# EAGLE design vixen1 (EAGLE 7.7.0)
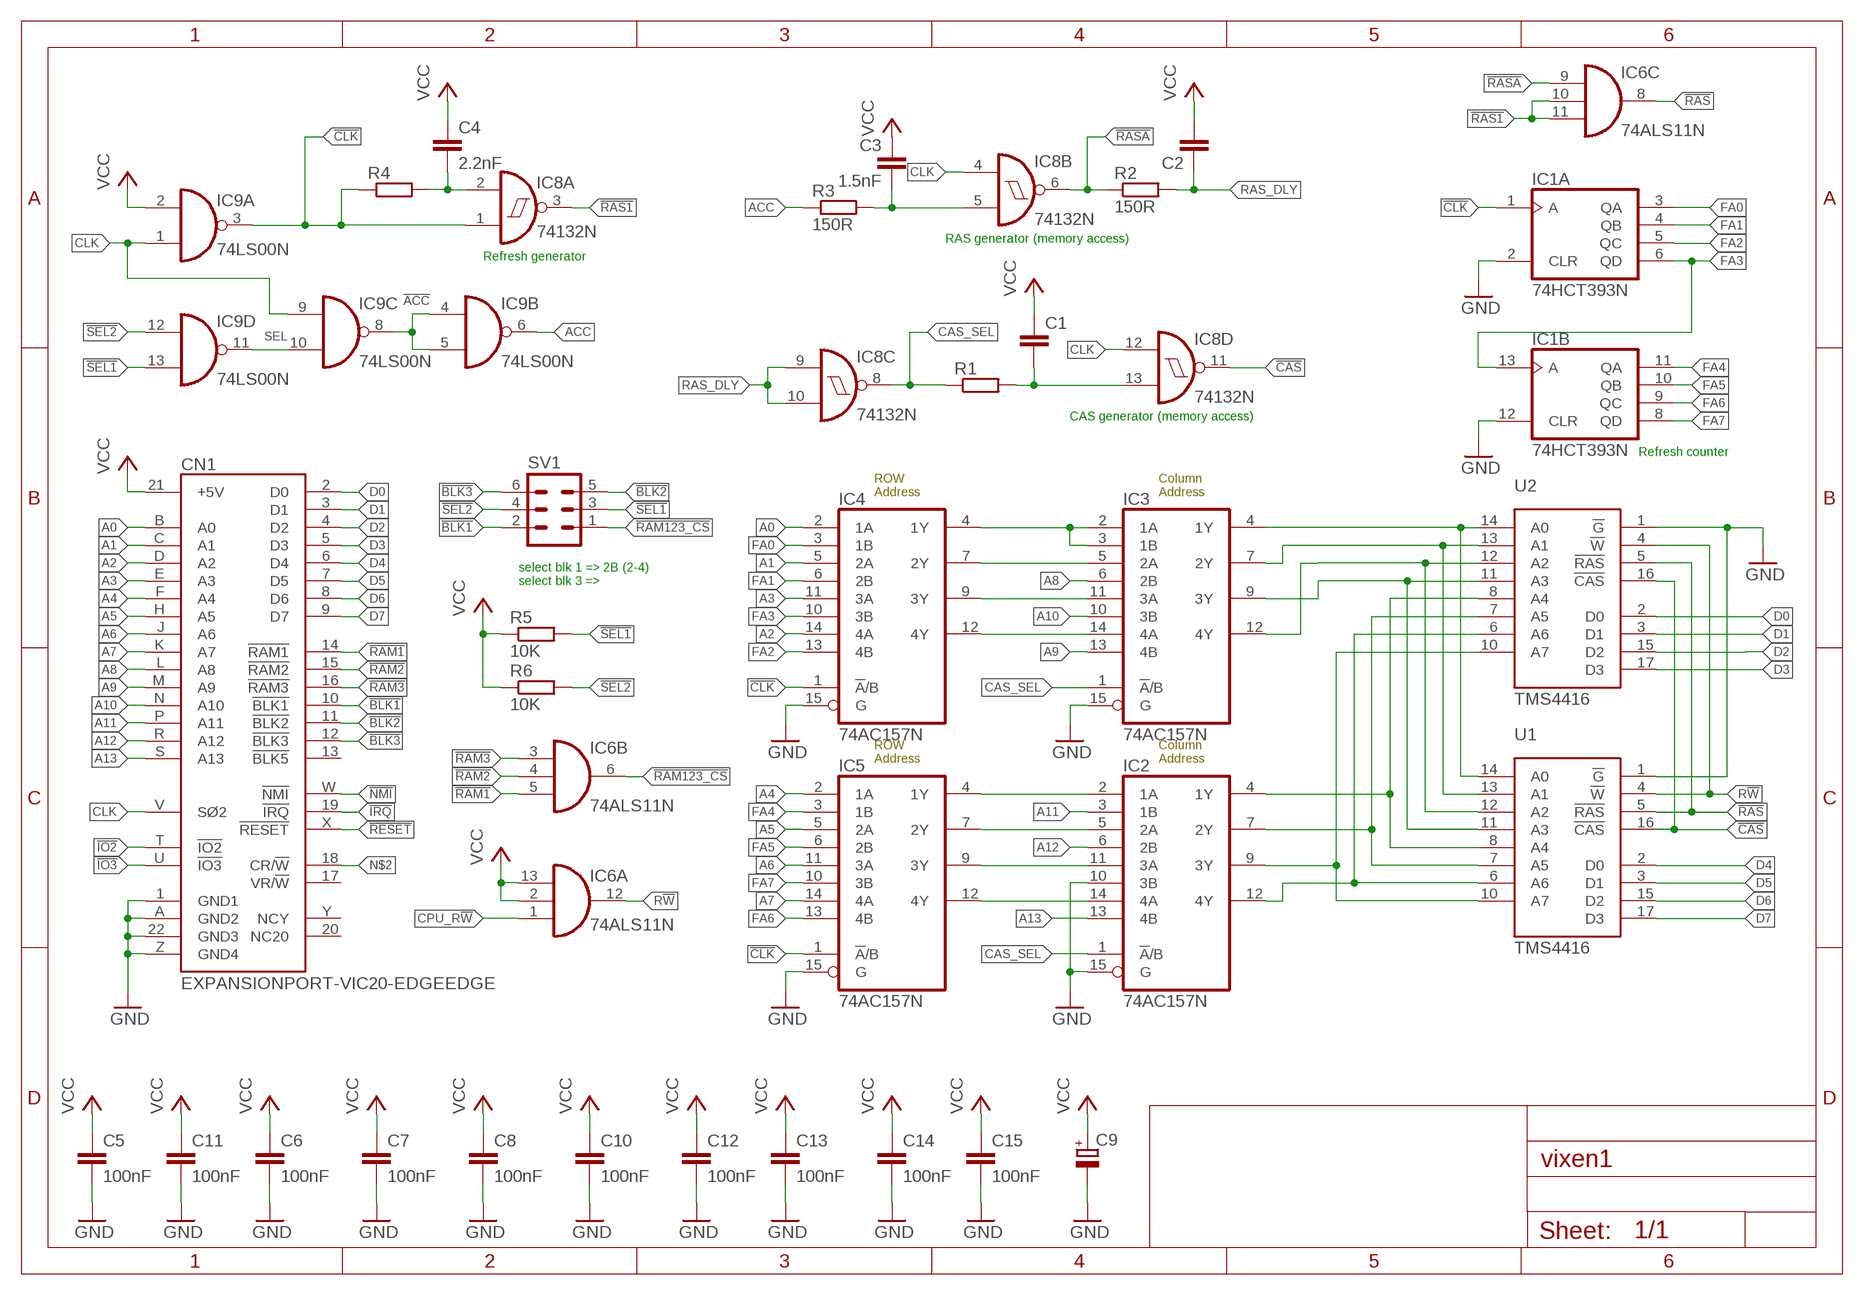
[diagram p0: schematic, sheet 1]

## Parts
C1  C-EU025-025X050  [C025-025X050]
C2  C-EU025-025X050  [C025-025X050]
C3  1.5nF  C-EU025-025X050  [C025-025X050]
C4  2.2nF  C-EU025-025X050  [C025-025X050]
C5  100nF  C-EU025-025X050  [C025-025X050]
C6  100nF  C-EU025-025X050  [C025-025X050]
C7  100nF  C-EU025-025X050  [C025-025X050]
C8  100nF  C-EU025-025X050  [C025-025X050]
C9  CPOL-EUE15-5AXIAL  [E15-5]
C10  100nF  C-EU025-025X050  [C025-025X050]
C11  100nF  C-EU025-025X050  [C025-025X050]
C12  100nF  C-EU025-025X050  [C025-025X050]
C13  100nF  C-EU025-025X050  [C025-025X050]
C14  100nF  C-EU025-025X050  [C025-025X050]
C15  100nF  C-EU025-025X050  [C025-025X050]
CN1  EXPANSIONPORT-VIC20-EDGEEDGE  [UPS44EDGE]
IC1  74HCT393N  [DIL14]
IC2  74AC157N  [DIL16]
IC3  74AC157N  [DIL16]
IC4  74AC157N  [DIL16]
IC5  74AC157N  [DIL16]
IC6  74ALS11N  [DIL14]
IC8  74132N  [DIL14]
IC9  74LS00N  [DIL14]
R1  R-EU_0204/7  [0204/7]
R2  150R  R-EU_0204/7  [0204/7]
R3  150R  R-EU_0204/7  [0204/7]
R4  R-EU_0204/7  [0204/7]
R5  10K  R-EU_0204/7  [0204/7]
R6  10K  R-EU_0204/7  [0204/7]
SV1  MA03-2  [MA03-2]
U1  TMS4416  [DIL18]
U2  TMS4416  [DIL18]

## Nets
!ACC: IC9.4(B:I0) IC9.5(B:I1) IC9.8(C:O)
!BLK1: CN1.10(!BLK1) SV1.2
!BLK2: CN1.11(!BLK2) SV1.5
!BLK3: CN1.12(!BLK3) SV1.6
!CAS: IC8.11(D:O) U1.16(!CAS) U2.16(!CAS)
!CLK: IC1.1(A:A) IC4.1(!A!/B) IC5.1(!A!/B) IC8.1(A:I0) IC9.3(A:O) R4.1
!IO2: CN1.T(!IO2)
!IO3: CN1.U(!IO3)
!IRQ: CN1.19(!IRQ)
!NMI: CN1.W(!NMI)
!RAM1: CN1.14(!RAM1) IC6.5(B:I2)
!RAM2: CN1.15(!RAM2) IC6.4(B:I1)
!RAM3: CN1.16(!RAM3) IC6.3(B:I0)
!RAM123_CS: IC6.6(B:O) SV1.1
!RAS: IC6.8(C:O) U1.5(!RAS) U2.5(!RAS)
!RAS1: IC6.10(C:I1) IC6.11(C:I2) IC8.3(A:O)
!RASA: IC6.9(C:I0) IC8.6(B:O) R2.1
!RESET: CN1.X(!RESET)
!SEL1: IC9.13(D:I1) R5.2 SV1.3
!SEL2: IC9.12(D:I0) R6.2 SV1.4
A0: CN1.B(A0) IC4.2(1A)
A1: CN1.C(A1) IC4.5(2A)
A2: CN1.D(A2) IC4.14(4A)
A3: CN1.E(A3) IC4.11(3A)
A4: CN1.F(A4) IC5.2(1A)
A5: CN1.H(A5) IC5.5(2A)
A6: CN1.J(A6) IC5.11(3A)
A7: CN1.K(A7) IC5.14(4A)
A8: CN1.L(A8) IC3.6(2B)
A9: CN1.M(A9) IC3.13(4B)
A10: CN1.N(A10) IC3.10(3B)
A11: CN1.P(A11) IC2.3(1B)
A12: CN1.R(A12) IC2.6(2B)
A13: CN1.S(A13) IC2.13(4B)
ACC: IC9.6(B:O) R3.1
CAS_RC: C1.2 IC8.13(D:I1) R1.2
CAS_RC1: C4.2 IC8.2(A:I1) R4.2
CAS_SEL: IC2.1(!A!/B) IC3.1(!A!/B) IC8.8(C:O) R1.1
CLK: CN1.V(SØ2) IC8.4(B:I0) IC8.12(D:I0) IC9.1(A:I0) IC9.9(C:I0)
CPU_R!W: IC6.1(A:I0)
D0: CN1.2(D0) U2.2(D0)
D1: CN1.3(D1) U2.3(D1)
D2: CN1.4(D2) U2.15(D2)
D3: CN1.5(D3) U2.17(D3)
D4: CN1.6(D4) U1.2(D0)
D5: CN1.7(D5) U1.3(D1)
D6: CN1.8(D6) U1.15(D2)
D7: CN1.9(D7) U1.17(D3)
FA0: IC1.3(A:QA) IC4.3(1B)
FA1: IC1.4(A:QB) IC4.6(2B)
FA2: IC1.5(A:QC) IC4.13(4B)
FA3: IC1.6(A:QD) IC1.13(B:A) IC4.10(3B)
FA4: IC1.11(B:QA) IC5.3(1B)
FA5: IC1.10(B:QB) IC5.6(2B)
FA6: IC1.9(B:QC) IC5.13(4B)
FA7: IC1.8(B:QD) IC5.10(3B)
GND: C5.2 C6.2 C7.2 C8.2 C9.- C10.2 C11.2 C12.2 C13.2 C14.2 C15.2 CN1.1(GND1) CN1.22(GND3) CN1.A(GND2) CN1.Z(GND4) IC1.2(A:CLR) IC1.12(B:CLR) IC2.10(3B) IC2.15(G) IC3.15(G) IC4.15(G) IC5.15(G) U1.1(!G) U2.1(!G)
N$2: CN1.18(CR/!W)
R!W: IC6.12(A:O) U1.4(!W) U2.4(!W)
RA0: IC3.4(1Y) U1.14(A0) U2.14(A0)
RA1: IC3.7(2Y) U1.13(A1) U2.13(A1)
RA2: IC3.12(4Y) U1.12(A2) U2.12(A2)
RA3: IC3.9(3Y) U1.11(A3) U2.11(A3)
RA4: IC2.4(1Y) U1.8(A4) U2.8(A4)
RA5: IC2.7(2Y) U1.7(A5) U2.7(A5)
RA6: IC2.12(4Y) U1.6(A6) U2.6(A6)
RA7: IC2.9(3Y) U1.10(A7) U2.10(A7)
RAS_DLY: C2.1 IC8.9(C:I0) IC8.10(C:I1) R2.2
RAS_RC1: C3.2 IC8.5(B:I1) R3.2
ROW0: IC3.2(1A) IC3.3(1B) IC4.4(1Y)
ROW1: IC3.5(2A) IC4.7(2Y)
ROW2: IC3.14(4A) IC4.12(4Y)
ROW3: IC3.11(3A) IC4.9(3Y)
ROW4: IC2.2(1A) IC5.4(1Y)
ROW5: IC2.5(2A) IC5.7(2Y)
ROW6: IC2.14(4A) IC5.12(4Y)
ROW7: IC2.11(3A) IC5.9(3Y)
SEL: IC9.10(C:I1) IC9.11(D:O)
VCC: C1.1 C2.2 C3.1 C4.1 C5.1 C6.1 C7.1 C8.1 C9.+ C10.1 C11.1 C12.1 C13.1 C14.1 C15.1 CN1.21(+5V) IC6.2(A:I1) IC6.13(A:I2) IC9.2(A:I1) R5.1 R6.1
Unconnected: CN1.13(!BLK5) CN1.17(VR/!W) CN1.20(NC20) CN1.Y(NCY)

## Notes on the sheet
- RAS generator (memory access)
- Refresh generator
- CAS generator (memory access)
- Refresh counter
- ROW
  Address
- Column
  Address
- select blk 1 => 2B (2-4)
  select blk 3 =>
- ROW
  Address
- Column
  Address

## Power pins joined to a net without a drawn wire
GND: IC1.7(P:GND) IC2.8(GND) IC3.8(GND) IC4.8(GND) IC5.8(GND) IC6.7(P:GND) IC8.7(P:GND) IC9.7(P:GND) U1.18(GND) U2.18(GND)
VCC: IC1.14(P:VCC) IC2.16(VCC) IC3.16(VCC) IC4.16(VCC) IC5.16(VCC) IC6.14(P:VCC) IC8.14(P:VCC) IC9.14(P:VCC) U1.9(VCC) U2.9(VCC)

## Library data of the parts
C1-C8 C10-C15 = rcl:C-EU: CAPACITOR, European symbol
C9 = rcl:CPOL-EU: POLARIZED CAPACITOR, European symbol
CN1 = 0RB_Commodore:EXPANSIONPORT-VIC20-EDGE: Expansionport of the Commodore VIC-20
IC1 = 74xx-eu:74*393: Dual 4-bit decade and binary COUNTER
IC2-IC5 = 74xx-eu:74*157: Quadruple 2-line to 1-line data SELECTOR/MULTIPLEXER
IC6 = 74xx-eu:74*11: Triple 3-input AND gate
IC8 = 74xx-eu:74*132: Quad 2-input NAND schmitt trigger
IC9 = 74xx-eu:74*00: Quad 2-input NAND gate
R1-R6 = rcl:R-EU_: RESISTOR, European symbol
SV1 = con-lstb:MA03-2: PIN HEADER; OC_FARNELL: unknown; OC_NEWARK: unknown
U1 U2 = tms4416:TMS4416

## Board
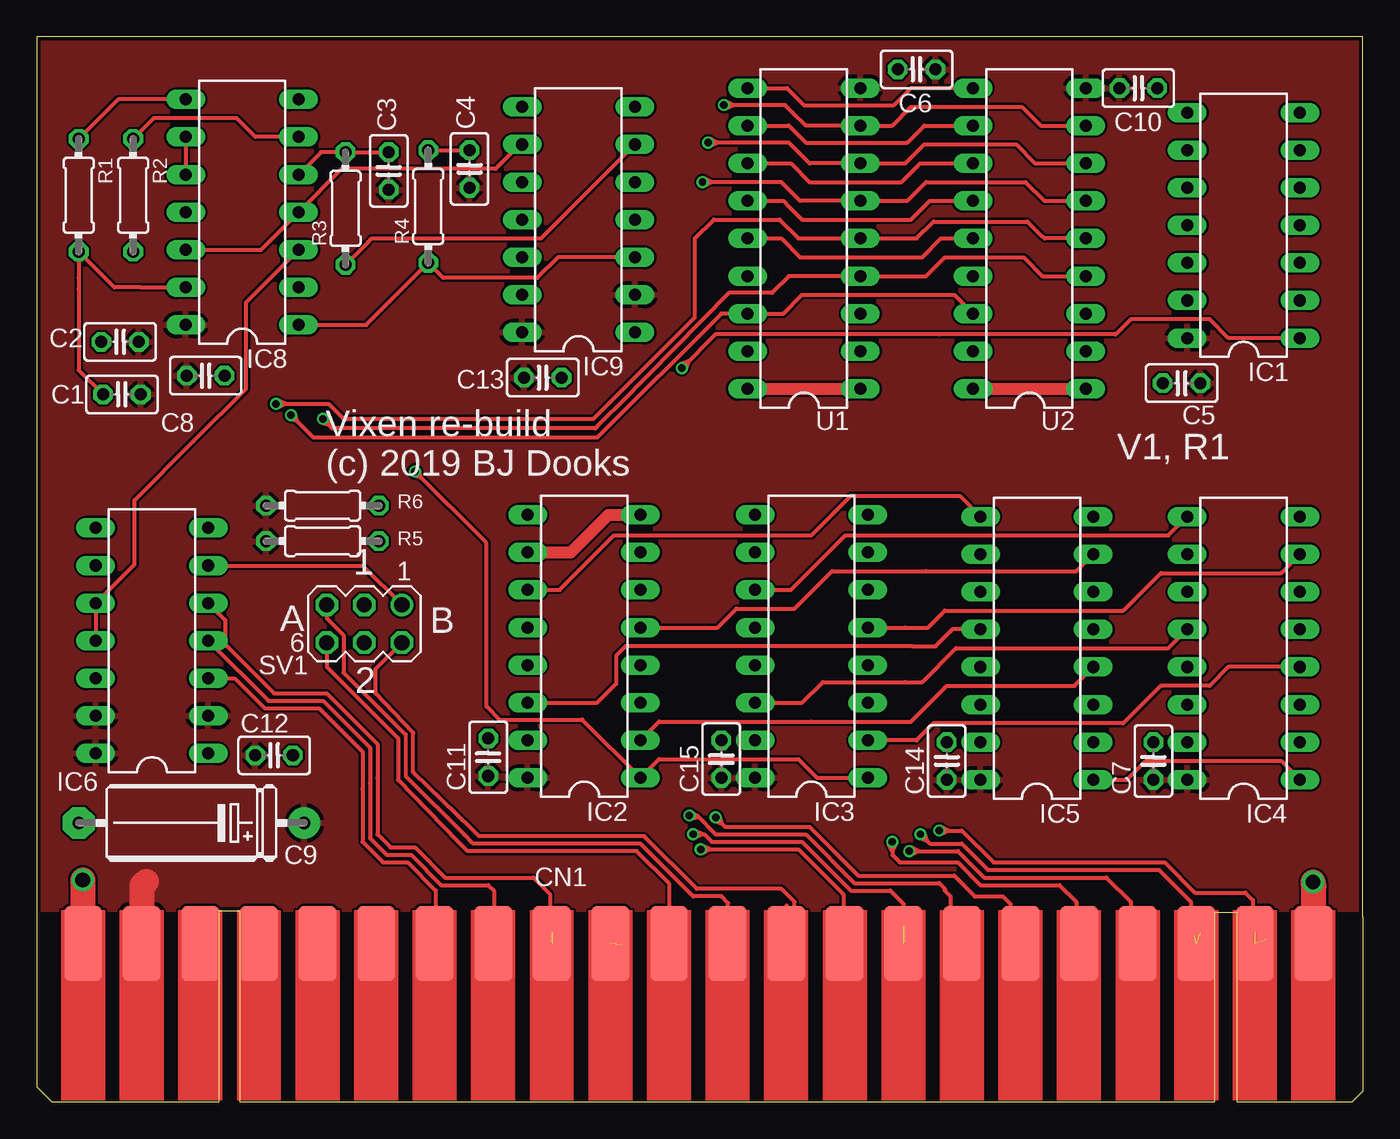
[diagram p1: board, top side]
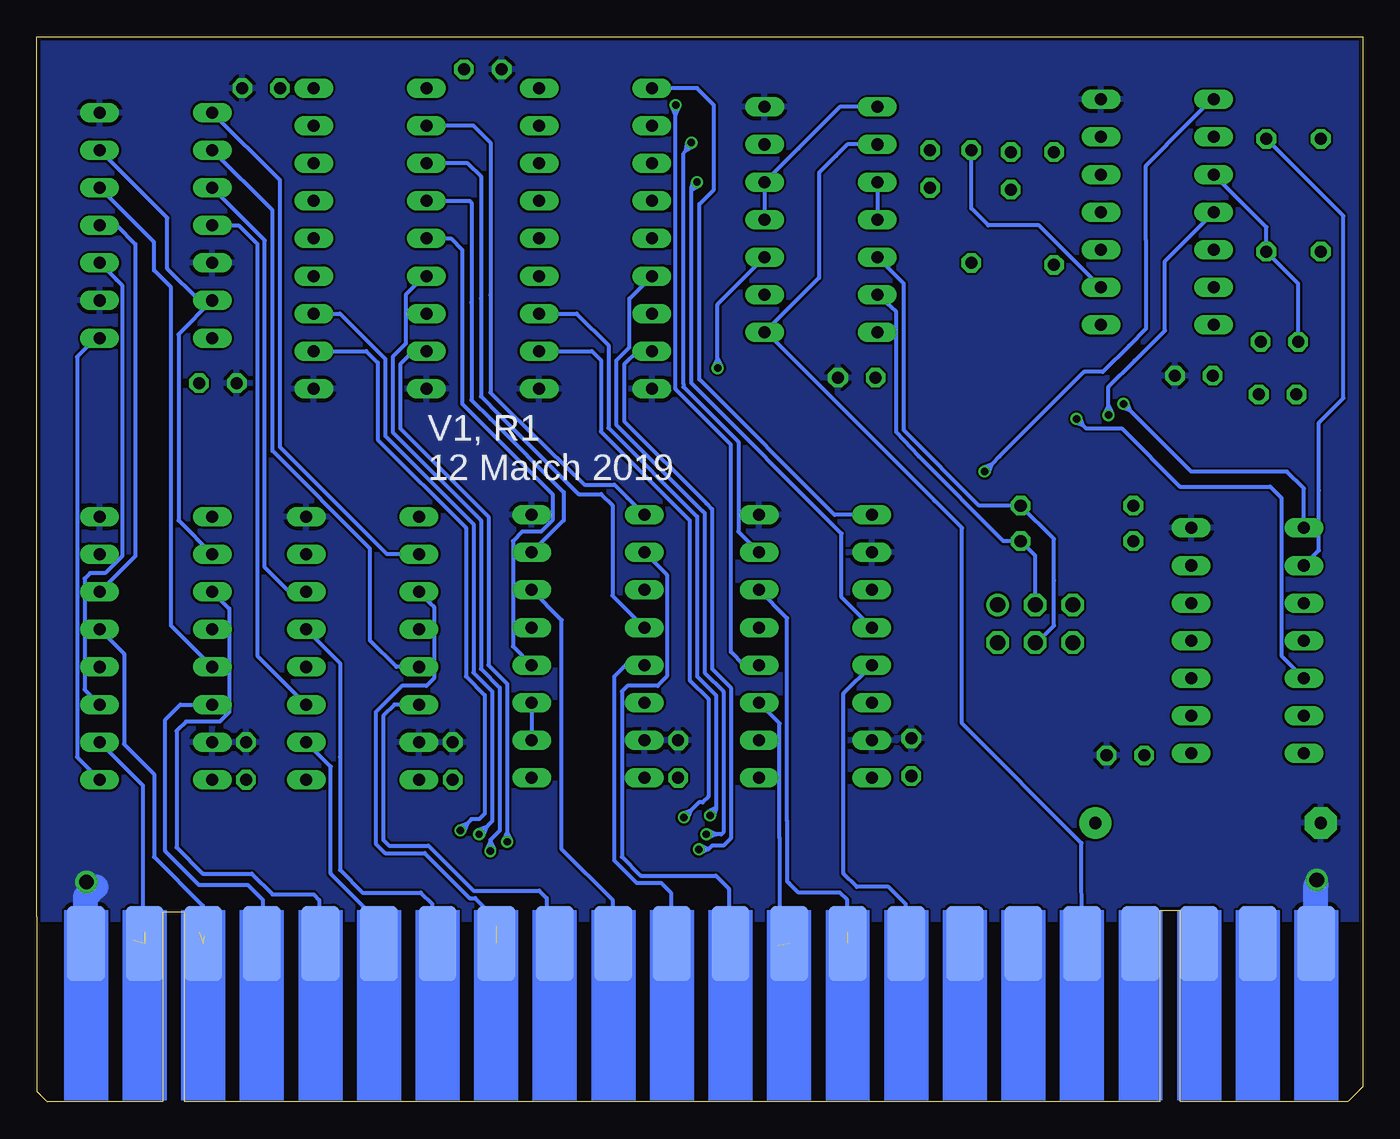
[diagram p2: board, bottom side, seen from below]

Size 89.6 x 71.93 mm. Coordinates in mm from the lower left corner, seen from the top.
Outline: 89.6,12.47 89.6,71.93 0,71.93 0,12.62
Copper layers (1*16): Top 0.035mm / dielectric 1.5mm / Bottom 0.035mm
Design rules "Elecrow_2-layer_eagle_rule *": minimum track width 6mil, minimum drill 12mil, track to track 6mil, track to pad 6mil, pad to pad 6mil, via to via 6mil, smd to smd 0mil, copper to edge 10mil, drill to drill 10mil, minimum pad ring 10mil, minimum via ring 6mil, stop-mask expansion 2mil, vias tented up to drill 100mil, thermal gap 10mil

### Footprints (pad centres in the part's own frame; a part is rotated, then mirrored left to right if it is on the bottom)
C025-025X050 = drill 0.813 octagon: 1 -1.27,0; 2 1.27,0
E15-5 = drill 0.813 pad 2.159: + -7.62,0 | drill 0.813 pad 2.159 octagon: - 7.62,0
UPS44EDGE = smd 2.54 x 5.08: 1 41.581,3.68; 2 37.621,3.68; 3 33.661,3.68; 4 29.701,3.68; 5 25.741,3.68; 6 21.781,3.68; 7 17.821,3.68; 8 13.861,3.68; 9 9.901,3.68; 10 5.941,3.68; 11 1.981,3.68; 12 -1.979,3.68; 13 -5.939,3.68; 14 -9.899,3.68; 15 -13.859,3.68; 16 -17.819,3.68; 17 -21.779,3.68; 18 -25.739,3.68; 19 -29.699,3.68; 20 -33.659,3.68; 21 -37.619,3.68; 22 -41.579,3.68 | smd 2.54 x 5.08 bottom: A 41.581,3.68; B 37.621,3.68; C 33.661,3.68; D 29.701,3.68; E 25.741,3.68; F 21.781,3.68; H 17.821,3.68; J 13.861,3.68; K 9.901,3.68; L 5.941,3.68; M 1.981,3.68; N -1.979,3.68; P -5.939,3.68; R -9.899,3.68; S -13.859,3.68; T -17.819,3.68; U -21.779,3.68; V -25.739,3.68; W -29.699,3.68; X -33.659,3.68; Y -37.619,3.68; Z -41.579,3.68
DIL14 = drill 0.813 long: 1 -7.62,-3.81; 2 -5.08,-3.81; 3 -2.54,-3.81; 4 0,-3.81; 5 2.54,-3.81; 6 5.08,-3.81; 7 7.62,-3.81; 8 7.62,3.81; 9 5.08,3.81; 10 2.54,3.81; 11 0,3.81; 12 -2.54,3.81; 13 -5.08,3.81; 14 -7.62,3.81
DIL16 = drill 0.813 long: 1 -8.89,-3.81; 2 -6.35,-3.81; 3 -3.81,-3.81; 4 -1.27,-3.81; 5 1.27,-3.81; 6 3.81,-3.81; 7 6.35,-3.81; 8 8.89,-3.81; 9 8.89,3.81; 10 6.35,3.81; 11 3.81,3.81; 12 1.27,3.81; 13 -1.27,3.81; 14 -3.81,3.81; 15 -6.35,3.81; 16 -8.89,3.81
0204/7 = drill 0.813 octagon: 1 -3.81,0; 2 3.81,0
MA03-2 = drill 1.016: 1 -2.54,-1.27 | drill 1.016 octagon: 2 -2.54,1.27; 3 0,-1.27; 4 0,1.27; 5 2.54,-1.27; 6 2.54,1.27
DIL18 = drill 0.813 long: 1 -10.16,-3.81; 2 -7.62,-3.81; 3 -5.08,-3.81; 4 -2.54,-3.81; 5 0,-3.81; 6 2.54,-3.81; 7 5.08,-3.81; 8 7.62,-3.81; 9 10.16,-3.81; 10 10.16,3.81; 11 7.62,3.81; 12 5.08,3.81; 13 2.54,3.81; 14 0,3.81; 15 -2.54,3.81; 16 -5.08,3.81; 17 -7.62,3.81; 18 -10.16,3.81

### Placement (x,y rotation side)
C1  5.74,47.78 180 top
C2  5.61,51.33 0 top
C3  23.78,62.89 90 top
C4  29.24,63.02 90 top
C5  77.37,48.54 180 top
C6  59.46,69.75 180 top
C7  75.46,23.01 90 top
C8  11.4,49.05 0 top
C9  10.44,18.82 180 top
C10  74.45,68.48 0 top
C11  30.51,23.27 90 top
C12  16.03,23.39 0 top
C13  34.19,48.92 0 top
C14  61.49,23.01 90 top
C15  46.25,23.14 90 top
CN1  44.7,7 0 top
IC1  81.56,59.21 90 top
IC2  36.98,30.76 90 top
IC3  52.35,30.76 90 top
IC4  81.56,30.63 90 top
IC5  67.59,30.63 90 top
IC6  7.77,31.14 90 top
IC8  13.87,60.09 90 top
IC9  36.6,59.59 90 top
R1  2.82,61.24 270 top
R2  6.5,61.24 270 top
R3  20.85,60.35 90 top
R4  26.44,60.48 90 top
R5  19.3,37.87 0 top
R6  19.3,40.27 0 top
SV1  22.12,32.28 180 top
U1  51.84,58.32 90 top
U2  67.08,58.32 90 top

### Tracks (layer width: path | path; a pad name or v marks a point on that pad's centre or on a via)
!ACC
  Bottom 0.254: IC9.4 IC9.5 38.13,64.41 36.35,66.19 35.33,67.21 IC9.8
!BLK1
  Top 0.254: CN1.10 50.67,13.26 50.67,12.5 51.21,11.96 51.21,13.49 50.32,14.38 44.6,14.38 41.05,17.93 29.87,17.93 29.36,18.44 25.43,22.25 25.43,24.92 22.89,27.58 22.89,29.23 SV1.2
!BLK2
  Top 0.254: SV1.5 19.58,32.66 20.73,31.52 20.73,28.98 24.92,24.79 24.92,22 28.86,18.06 29.49,17.42 40.79,17.42 44.35,13.87 46.25,13.87 46.71,13.41 CN1.11
!BLK3
  Top 0.254: SV1.6 19.58,29.36 24.41,24.54 24.41,21.74 28.47,17.55 29.11,16.91 40.54,16.91 42.75,14.7 CN1.12 42.83,10.76
!CAS  (via drill 0.5)
  Top 0.254: 18.7,44.86 18.57,44.98 | 18.57,44.98 v17.17,46.38 | 18.7,44.86 37.87,44.86 46.25,53.24 U1.16 50.45,53.24 51.72,54.51 62,54.51 U2.16 | 18.7,44.86 18.57,44.98 | v17.17,46.38 17.43,46.47 17.63,45.92 17.08,46.12 v17.17,46.38
  Bottom 0.254: v17.17,46.38 17.17,48.28 15.39,50.06 15.27,50.19 13.36,52.09 13.36,56.79 IC8.11 | v17.17,46.38 16.92,46.5 17.17,47.03 17.42,46.5 v17.17,46.38
!CLK  (via drill 0.5)
  Top 0.254: IC8.1 22.25,52.47 R4.1 27.46,55.65 33.81,55.65 35.21,57.05 IC9.3 | IC1.1 80.54,51.59 79.27,52.86 73.94,52.86 72.92,51.84 60.99,51.84 45.87,51.84 v43.59,49.55 | IC5.1 73.69,21.74 74.83,22.88 74.96,23.01 84.1,23.01 IC4.1 | v43.59,49.55 43.49,49.81 44.05,50.01 43.85,49.46 v43.59,49.55
  Bottom 0.254: v43.59,49.55 43.59,53.87 IC9.3 | IC1.1 85.62,51.59 86.89,50.32 86.89,23.27 IC4.1 | v43.59,49.55 43.34,49.67 43.59,50.2 43.84,49.67 v43.59,49.55
!RAM1  (1 unrouted)
  Top 0.254: IC6.5 12.73,32.54 12.73,30.88 16.03,27.58 19.58,27.58 23.01,24.15 23.01,21.87 23.01,18.06 23.9,17.17 25.55,17.17 27.59,15.14 33.55,15.14 34.7,13.99 34.7,11.58 34.82,11.45
!RAM2
  Top 0.254: IC6.4 15.65,27.07 19.33,27.07 22.51,23.9 22.51,21.49 22.51,17.8 23.52,16.79 23.65,16.66 25.3,16.66 27.33,14.63 30.51,14.63 30.89,14.25 30.89,11.58 31.4,11.07 31,11.07 30.87,11.2 | CN1.15 30.87,11.2 | 30.87,11.2 30.87,13.12
!RAM3
  Top 0.254: IC6.3 13.36,28.6 15.39,26.57 19.08,26.57 22,23.65 22,21.11 22,17.55 23.39,16.15 25.05,16.15 26.95,14.25 26.95,11.45 26.82,11.33 26.82,10.78 CN1.16
!RAM123_CS
  Top 0.254: IC6.6 22,36.22 SV1.1
!RAS  (via drill 0.5)
  Top 0.254: U2.5 68.1,58.32 67.97,58.44 66.95,59.46 60.61,59.46 59.46,58.32 U1.5 51.46,58.32 50.19,59.59 45.75,59.59 44.48,58.32 44.48,52.98 38.63,47.14 37.62,46.12 20.73,46.12 19.71,47.14 v16.16,47.14 | v16.16,47.14 16.27,47.39 16.81,47.14 16.27,46.89 v16.16,47.14
  Bottom 0.254: IC6.8 3.96,41.43 5.11,42.57 11.58,42.57 v16.16,47.14 | v16.16,47.14 16.25,46.88 15.7,46.68 15.9,47.23 v16.16,47.14
!RAS1
  Top 0.254: IC6.11 IC6.10 6.6,36.32 6.6,40.63 10.57,44.6 14.12,48.16 14.12,54 IC8.3
!RASA
  Top 0.254: IC8.6 14.76,65.17 13.49,66.44 7.9,66.44 R2.1
  Bottom 0.254: IC6.9 2.95,37.23 2.95,41.3 2.95,45.87 1.93,46.89 1.3,47.52 1.3,59.84 R2.1
!SEL1
  Bottom 0.254: IC9.13 31.52,53.36 31.52,45.24 30,43.58 24.28,37.87 R5.2 22.12,36.88 SV1.3
!SEL2
  Bottom 0.254: SV1.4 22,31.01 20.85,32.16 20.85,35.2 20.85,38.01 R6.2 25.92,40.27 31.01,45.36 31.01,55.27 IC9.12
A0  (1 unrouted)
  Bottom 0.254: IC4.2 82.45,21.36 82.45,11.58 83.08,10.95
A1  (1 unrouted)
  Bottom 0.254: IC4.5 83.72,30.25 83.72,24.15 81.69,22.12 81.69,16.53 78.39,13.23 78.39,11.33 78.51,11.2 78.26,11.2 | CN1.C 78.39,10.69 78.77,10.31
A2
  Bottom 0.254: CN1.D 74.32,10.8 74.32,13.61 75.34,14.63 78.64,14.63 80.92,16.91 80.92,25.8 79.91,26.82 IC4.14
A3
  Bottom 0.254: IC4.11 76.61,33.3 76.61,26.31 77.24,25.68 79.53,25.68 80.16,25.04 80.16,17.17 78.39,15.39 75.08,15.39 73.69,13.99 70.89,13.99 70.51,13.61 70.51,10.73 CN1.E
A4
  Bottom 0.254: CN1.F 66.7,10.88 66.7,12.34 69.5,15.14 69.75,15.39 69.75,22.63 IC5.2
A5
  Bottom 0.254: IC5.5 69.11,29.61 69.11,23.27 69.11,15.64 67.59,14.12 63.65,14.12 62.89,13.36 62.89,12.09 | 62.89,12.09 62.51,12.47 62.76,12.72 | 62.89,12.09 63.02,11.96 63.02,11.16 CN1.H
A6  (1 unrouted)
  Bottom 0.254: IC5.11 63.02,33.68 62.76,33.42 62.76,28.6 63.27,28.09 64.92,28.09 66.7,26.31 66.7,17.42 66.07,16.79 63.4,16.79 60.35,13.74 59.97,13.74 58.57,12.34 58.57,11.83
A7
  Bottom 0.254: IC5.14 65.43,26.82 66.19,26.06 66.19,17.68 65.81,17.3 63.14,17.3 61.11,15.26 60.1,14.25 55.65,14.25 55.14,13.74 55.14,11.71 54.64,11.2 54.76,11.2 54.76,10.82 CN1.K
A8
  Bottom 0.254: CN1.L 50.67,13.58 54.13,17.04 54.13,32.54 IC3.6
A9
  Bottom 0.254: CN1.M 46.71,14.07 47.4,14.76 49.05,14.76 50.57,16.28 50.57,28.73 49.81,29.49 IC3.13
A10
  Bottom 0.254: IC3.10 47.02,35.58 47.02,28.73 47.65,28.09 49.68,28.09 50.06,27.71 50.06,16.53 48.79,15.26 43.71,15.26 42.83,14.38 42.83,11.83 42.95,11.71 42.95,10.89 CN1.N
A11  (1 unrouted)
  Bottom 0.254: IC2.3 39.4,25.55 39.4,17.8 39.4,11.33 39.78,10.95 39.78,10.82 39.52,10.56
A12
  Bottom 0.254: CN1.R 34.83,13.24 34.83,13.62 35.33,14.12 38.13,14.12 38.76,14.76 38.89,14.88 38.89,18.95 38.89,32.66 IC2.6
A13
  Bottom 0.254: CN1.S 30.87,13.34 32.03,14.5 34.19,14.5 35.08,15.39 35.08,27.58 IC2.13
ACC
  Top 0.254: IC9.6 38,62.25 36.09,60.35 34.06,58.32 22.63,58.32 22.38,58.06 R3.1
CAS_RC
  Top 0.254: C1.2 2.82,49.43 2.82,54.89 2.82,55.65 R1.2 5.23,55.02 7.01,55.02 IC8.13
CAS_RC1
  Top 0.254: R4.2 C4.2
  Bottom 0.254: IC8.2 21.87,59.21 25.3,59.21 26.44,60.35 R4.2
CAS_SEL  (via drill 0.5)
  Top 0.254: IC3.1 52.73,21.87 51.46,23.14 47.4,23.14 42.06,23.14 IC2.1 36.86,25.8 31.27,25.8 30.38,26.69 30.38,37.74 v25.55,42.57 | R1.1 4.85,67.08 | 4.85,67.08 5.23,67.46 | IC8.8 5.49,67.71 4.85,67.08 | v25.55,42.57 25.81,42.66 26.01,42.11 25.46,42.31 v25.55,42.57
  Bottom 0.254: IC8.8 10.19,67.71 13.23,64.67 13.23,64.64 14.6,63.27 14.63,63.24 14.63,58.19 14.63,52.22 15.77,51.08 17.55,49.3 18.82,49.3 24.54,43.58 25.05,43.08 25.17,42.95 v25.55,42.57 | v25.55,42.57 25.29,42.47 25.09,43.03 25.65,42.83 v25.55,42.57
CLK
  Top 0.254: IC9.9 32.67,64.67 31.01,63.02 20.6,63.02 IC8.4 15.14,57.55 IC8.12
  Bottom 0.254: IC9.9 34.82,64.67 35.59,63.91 36.73,62.76 36.73,55.65 IC9.1 40.29,51.97 29.17,40.85 | 29.17,40.85 28.86,40.54 | CN1.V 18.99,17.46 27.08,25.55 27.08,38.76 29.17,40.85
D0  (via drill 0.5)  (1 unrouted)
  Top 0.254: v60.99,18.31 62.51,18.31 64.67,16.15 76.23,16.15 78.26,14.12 81.69,14.12 82.2,13.61 82.2,11.58 82.32,11.45 | v60.99,18.31 61.1,18.56 61.64,18.31 61.1,18.06 v60.99,18.31
  Bottom 0.254: U2.2 67.34,50.7 66.57,49.94 66.57,44.73 60.61,38.76 60.61,28.73 59.34,27.46 59.34,19.45 59.72,19.07 60.22,19.07 v60.99,18.31 | v60.99,18.31 60.73,18.22 60.53,18.77 61.08,18.57 v60.99,18.31
D1  (via drill 0.5)  (1 unrouted)
  Top 0.254: v59.72,18.06 60.35,17.42 62.51,17.42 64.29,15.64 75.84,15.64 78,13.49 78,12.09 78.64,11.45 | v59.72,18.06 59.98,18.15 60.18,17.6 59.62,17.8 v59.72,18.06
  Bottom 0.254: U2.3 69.11,53.24 66.07,50.19 66.07,44.98 60.1,39.01 60.1,28.98 58.83,27.71 58.83,18.95 59.46,18.31 v59.72,18.06 | v59.72,18.06 59.46,17.96 59.26,18.52 59.81,18.32 v59.72,18.06
D2  (via drill 0.5)
  Top 0.254: v58.95,16.91 62.26,16.91 64.03,15.14 72.29,15.14 73.94,13.49 73.94,11.18 CN1.4 | v58.95,16.91 59.07,17.16 59.6,16.91 59.07,16.67 v58.95,16.91
  Bottom 0.254: U2.15 63.4,55.78 64.67,54.51 64.67,51.2 65.56,50.32 65.56,49.81 65.56,49.55 65.56,45.24 59.59,39.27 59.59,29.23 58.32,27.96 58.32,18.31 58.95,17.68 v58.95,16.91 | v58.95,16.91 58.71,17.03 58.95,17.57 59.2,17.03 v58.95,16.91
D3  (via drill 0.5)
  Top 0.254: v57.81,17.55 57.81,16.66 58.32,16.15 62.26,16.15 63.78,14.63 69.11,14.63 70.26,13.49 70.26,10.9 CN1.5 | v57.81,17.55 58.06,17.43 57.81,16.9 57.56,17.43 v57.81,17.55
  Bottom 0.254: U2.17 64.16,50.7 65.05,49.81 65.05,45.49 59.08,39.52 59.08,29.49 57.81,28.22 v57.81,17.55 | v57.81,17.55 57.56,17.67 57.81,18.2 58.06,17.67 v57.81,17.55
D4  (via drill 0.5)
  Top 0.254: v45.87,19.2 46.38,18.69 46.51,18.57 52.22,18.57 55.53,15.26 62,15.26 63.4,13.87 65.3,13.87 65.81,13.36 65.81,11.2 66.95,10.06 66.95,10.24 CN1.6 | v45.87,19.2 46.13,19.29 46.33,18.74 45.78,18.94 v45.87,19.2
  Bottom 0.254: U1.2 52.1,50.7 51.49,50.09 51.49,45.26 45.49,39.27 45.49,28.47 44.22,27.2 44.22,20.6 44.6,20.22 44.86,20.22 v45.87,19.2 | v45.87,19.2 45.61,19.11 45.41,19.66 45.97,19.46 v45.87,19.2
D5  (via drill 0.5)
  Top 0.254: v44.1,19.33 44.6,19.33 45.87,18.06 51.97,18.06 55.27,14.76 60.99,14.76 61.37,14.38 61.37,14.25 61.75,13.87 61.75,11.83 62.38,11.2 62.38,10.86 CN1.7 | v44.1,19.33 44.26,19.55 44.73,19.2 44.16,19.06 v44.1,19.33
  Bottom 0.254: U1.3 53.11,53.24 50.98,51.11 50.98,45.52 44.98,39.52 44.98,28.73 43.71,27.46 43.71,19.71 v44.1,19.33 | v44.1,19.33 43.82,19.28 43.71,19.86 44.23,19.57 v44.1,19.33
D6  (via drill 0.5)
  Top 0.254: v44.35,18.06 45.11,18.06 45.62,17.55 51.72,17.55 55.02,14.25 57.68,14.25 58.57,13.36 58.57,11.45 58.57,11.33 58.57,10.71 CN1.8 | v44.35,18.06 44.47,18.31 45,18.06 44.47,17.81 v44.35,18.06
  Bottom 0.254: v44.35,18.06 43.33,18.06 43.21,18.18 43.21,27.71 44.48,28.98 44.48,39.78 44.6,39.9 50.45,45.74 50.45,50.06 49.56,50.95 49.56,54.25 U1.15 | v44.35,18.06 44.23,17.81 43.7,18.06 44.23,18.31 v44.35,18.06
D7  (via drill 0.5)
  Top 0.254: v44.86,17.04 51.46,17.04 54.51,13.99 54.51,12.09 53.75,11.33 53.99,11.33 CN1.9 | v44.86,17.04 44.97,17.29 45.51,17.04 44.97,16.79 v44.86,17.04
  Bottom 0.254: U1.17 49.02,50.7 49.91,49.81 49.91,45.97 44.35,40.41 43.97,40.03 43.97,29.23 42.7,27.96 42.7,17.8 43.21,17.3 43.97,17.3 44.22,17.04 v44.86,17.04 | v44.86,17.04 44.73,16.79 44.21,17.06 44.75,17.29 v44.86,17.04
FA0
  Bottom 0.254: IC1.3 84.23,55.52 83.85,55.14 83.85,36.85 84.99,35.71 86.01,35.71 86.39,35.33 86.39,27.84 IC4.3
FA1
  Bottom 0.254: IC1.4 84.23,59.21 82.96,57.94 82.96,36.85 IC4.6
FA2
  Bottom 0.254: IC4.13 80.54,32.16 80.54,38.89 80.54,55.02 81.69,56.16 81.69,58.06 IC1.5
FA3
  Bottom 0.254: IC1.6 80.8,59.71 80.8,56.28 78.64,54.13 IC1.13 80.04,51.84 80.04,39.27 IC4.10
FA4
  Bottom 0.254: IC1.11 75.97,59.21 74.83,58.06 74.7,57.94 74.7,30.12 IC5.3
FA5
  Bottom 0.254: IC5.6 72.54,34.44 74.19,36.09 74.19,58.19 IC1.10
FA6
  Bottom 0.254: IC5.13 65.3,29.36 67.08,31.14 67.08,37.36 73.69,43.97 73.69,60.22 IC1.9
FA7
  Bottom 0.254: IC5.10 65.94,36.98 73.18,44.22 73.18,62.25 IC1.8
GND  (via drill 1)
  Top 0.813: U2.18 U2.1 | U1.18 U1.1 | IC2.10 33.3,37.11 36.09,37.11 38.63,39.65 IC2.8
  Top 1.676: CN1.A 86.31,14.58 v86.26,14.83 | CN1.22 3.12,14.95 v3.1,14.97
  Bottom 1.016: CN1.A 86.31,11.15 86.01,11.45
  Bottom 1.676: CN1.A 86.31,13.81 85.62,14.5 | CN1.22 3.15,14.63
  pour Bottom: -6.07,83.59 103.15,83.59 103.66,18.44 104.04,12.34 -5.18,12.34
R!W  (via drill 0.5)
  Top 0.254: U2.4 67.97,55.78 66.7,57.05 61.37,57.05 60.1,55.78 U1.4 50.83,55.78 49.68,54.63 46.76,54.63 39.4,47.14 38.38,46.12 37.87,45.62 37.75,45.49 19.97,45.49 v19.33,46.12 | v19.33,46.12 19.59,46.22 19.79,45.67 19.24,45.87 v19.33,46.12
  Bottom 0.254: v19.33,46.12 18.7,45.49 16.28,45.49 12.35,41.55 6.25,41.55 5.49,40.79 5.49,30.12 IC6.12 | v19.33,46.12 19.42,45.87 18.87,45.67 19.07,46.22 v19.33,46.12
RA0
  Top 0.254: U1.14 50.32,58.32 51.59,57.05 59.84,57.05 61.11,58.32 U2.14
  Bottom 0.254: U2.14 61.62,58.32 60.86,57.55 60.86,53.75 60.86,47.14 59.59,45.87 54.76,41.05 54.76,39.27 55.53,38.5 56.8,38.5 57.43,37.87 57.43,30.76 IC3.4
RA1
  Top 0.254: U1.13 50.45,60.86 50.83,60.48 51.72,59.59 59.08,59.59 60.35,60.86 U2.13
  Bottom 0.254: U2.13 60.35,60.86 60.22,60.73 60.22,54 60.22,47.39 58.95,46.12 54,41.17 54,39.27 IC3.7
RA2
  Top 0.254: U1.12 50.95,63.4 52.22,62.13 58.45,62.13 59.72,63.4 U2.12
  Bottom 0.254: IC3.12 50.7,34.19 50.7,40.28 51.46,41.05 52.98,41.05 58.32,46.38 59.59,47.65 59.59,54.25 59.59,62.51 60.48,63.4 U2.12
RA3
  Top 0.254: U1.11 50.83,65.94 51.97,64.79 58.83,64.79 59.97,65.94 U2.11
  Bottom 0.254: IC3.9 49.68,40.79 50.57,41.68 52.6,41.68 57.68,46.63 58.95,47.9 58.95,54.51 58.95,64.79 60.1,65.94 U2.11
RA4  (via drill 0.5)
  Top 0.254: U2.8 67.84,65.94 66.57,67.21 59.08,67.21 57.81,65.94 U1.8 51.97,65.94 51.08,66.83 50.57,67.33 v46.44,67.33 | v46.44,67.33 46.55,67.58 47.09,67.33 46.55,67.08 v46.44,67.33
  Bottom 0.254: 40.67,29.49 IC2.4 41.81,29.49 42.7,30.38 42.7,44.39 46.44,48.13 46.44,66.8 v46.44,67.33 | v46.44,67.33 46.68,67.22 46.44,66.68 46.19,67.22 v46.44,67.33
RA5  (via drill 0.5)
  Top 0.254: U2.7 67.46,63.4 66.19,64.67 59.97,64.67 59.72,64.41 58.7,63.4 U1.7 52.22,63.4 51.08,64.54 50.83,64.79 v45.37,64.79 | v45.37,64.79 45.48,65.04 46.02,64.79 45.48,64.55 v45.37,64.79
  Bottom 0.254: v45.37,64.79 45.9,64.03 45.9,48.51 45.9,48.28 42.19,44.57 42.19,38.5 IC2.7 | v45.37,64.79 45.64,64.84 45.74,64.26 45.23,64.55 v45.37,64.79
RA6  (via drill 0.5)
  Top 0.254: U2.6 68.1,60.86 66.83,62.13 60.1,62.13 58.83,60.86 U1.6 51.59,60.86 50.57,61.87 50.32,62.13 v44.98,62.13 | v44.98,62.13 45.1,62.38 45.63,62.13 45.1,61.88 v44.98,62.13
  Bottom 0.254: IC2.12 35.21,34.06 35.21,38.38 45.37,48.54 45.37,61.75 v44.98,62.13 | v44.98,62.13 45.26,62.18 45.37,61.6 44.85,61.89 v44.98,62.13
RA7
  Top 0.254: U1.10 50.7,68.48 51.84,67.33 57.94,67.33 58.45,67.84 | 58.45,67.84 58.83,68.22 | U2.10 59.08,68.48 58.45,67.84
  Bottom 0.254: 47.91,68.48 U1.10 44.98,68.48 44.1,67.59 43.84,67.33 43.84,61.62 44.83,60.63 44.83,48.79 35.69,39.65 33.3,39.65 IC2.9
RAS_DLY
  Top 0.254: IC8.9 IC8.10
  Bottom 0.254: IC8.10 6.5,59.08 R2.2 4.34,55.27 C2.1
RAS_RC1
  Top 0.254: C3.2 R3.2 19.2,64.16 IC8.5
ROW0
  Top 0.254: IC4.4 80.54,29.36 79.27,28.09 75.97,28.09 73.43,25.55 60.61,25.55 59.46,24.41 IC3.2
  Bottom 0.254: IC3.3 IC3.2
ROW1
  Top 0.254: IC3.5 58.7,32.03 60.22,32.03 61.37,33.17 73.43,33.17 75.97,35.71 84.1,35.71 IC4.7
ROW2
  Top 0.254: IC3.14 51.72,26.95 53.11,28.34 58.7,28.34 59.84,28.34 62.13,30.63 76.48,30.63 IC4.12
ROW3
  Top 0.254: IC3.11 50.95,34.57 52.22,35.84 54.64,38.25 58.45,38.25 76.48,38.25 IC4.9
ROW4
  Top 0.254: IC2.2 42.06,25.68 52.35,25.68 59.08,25.68 61.37,27.96 61.49,28.09 70.13,28.09 IC5.4
ROW5
  Top 0.254: IC2.5 46,32.03 47.27,33.3 51.21,33.3 53.75,35.84 60.1,35.84 70.26,35.84 IC5.7
ROW6
  Top 0.254: IC2.14 37.87,26.95 39.14,28.22 39.14,30.12 39.78,30.76 59.21,30.76 60.73,30.76 61.75,31.77 61.88,31.9 IC5.12
ROW7
  Top 0.254: IC2.11 35.33,34.57 39.02,38.25 52.35,38.25 55.02,40.92 62.38,40.92 IC5.9
SEL
  Bottom 0.254: IC9.10 IC9.11
VCC
  Top 1.676: CN1.21 7.11,14.6 7.39,14.88
  pour Top: -6.2,84.86 101.63,84.86 102.13,12.98 -5.69,12.98

### Text on the board
tNames: V1, R1 | Vixen re-build / (c) 2019 BJ Dooks | 1 | A | B | 2
bNames: V1, R1 / 12 March 2019